# EAGLE design bldc_driver (EAGLE 6.6.0)
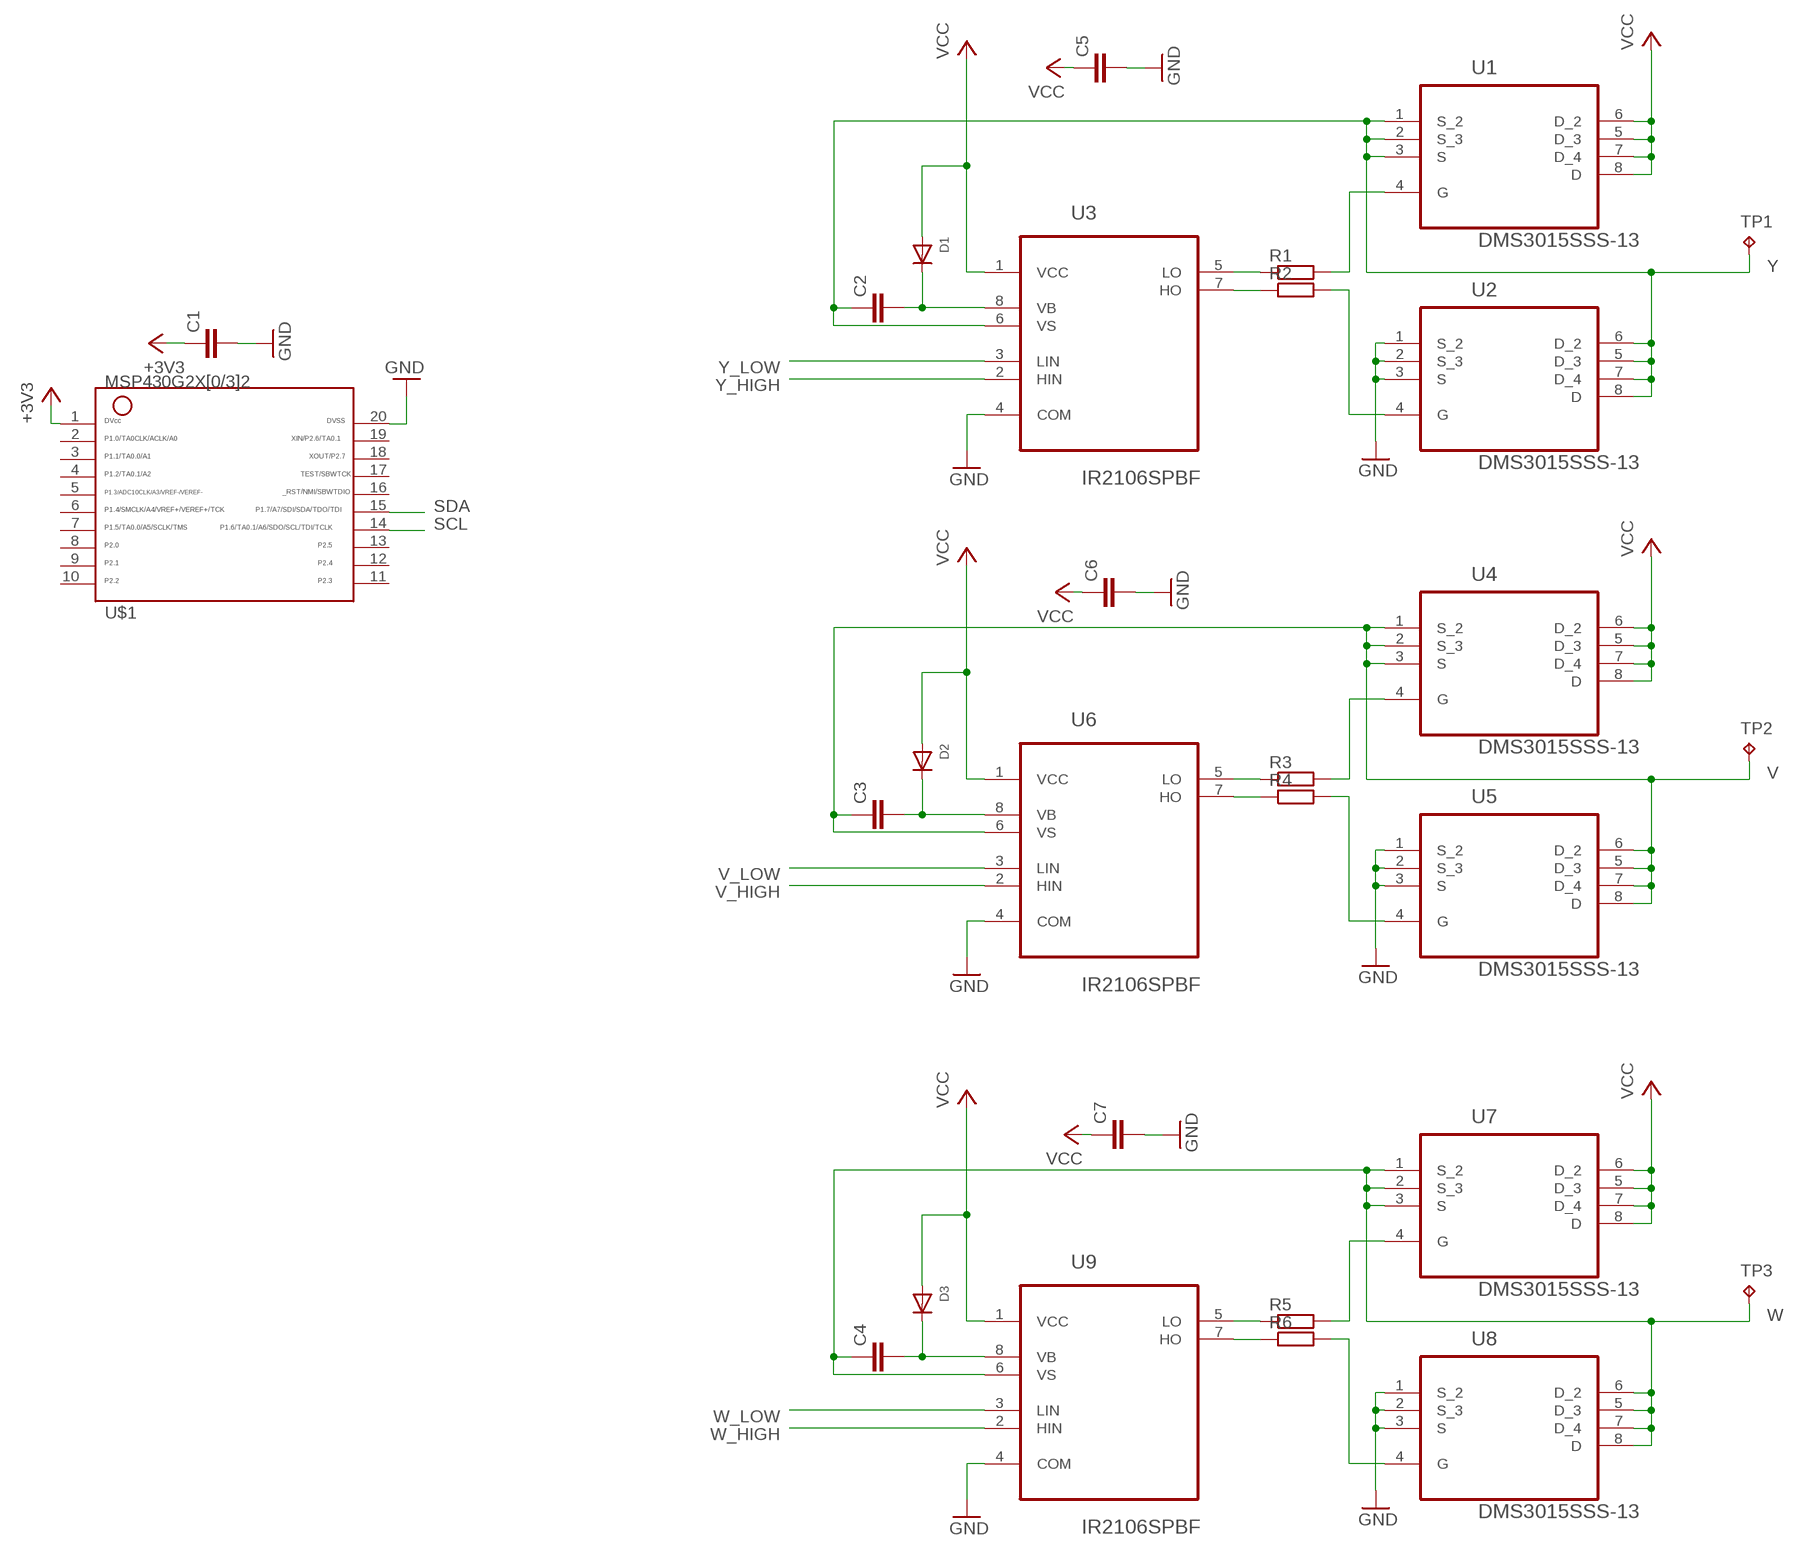
[diagram p0: schematic, sheet 1]

## Parts
C1  C-EUC0805  [C0805]
C2  C-EUC0805  [C0805]
C3  C-EUC0805  [C0805]
C4  C-EUC0805  [C0805]
C5  C-EUC0805  [C0805]
C6  C-EUC0805  [C0805]
C7  C-EUC0805  [C0805]
D1  DIODE_SOD-123FL  [SOD-123FL]
D2  DIODE_SOD-123FL  [SOD-123FL]
D3  DIODE_SOD-123FL  [SOD-123FL]
R1  R-EU_M0805  [M0805]
R2  R-EU_M0805  [M0805]
R3  R-EU_M0805  [M0805]
R4  R-EU_M0805  [M0805]
R5  R-EU_M0805  [M0805]
R6  R-EU_M0805  [M0805]
TP1  TPTP18R  [TP18R]
TP2  TPTP18R  [TP18R]
TP3  TPTP18R  [TP18R]
U1  DMS3015SSS-13  [SOIC127P600X175-8N]
U2  DMS3015SSS-13  [SOIC127P600X175-8N]
U3  IR2106SPBF  [SOIC127P600X175-8N]
U4  DMS3015SSS-13  [SOIC127P600X175-8N]
U5  DMS3015SSS-13  [SOIC127P600X175-8N]
U6  IR2106SPBF  [SOIC127P600X175-8N]
U7  DMS3015SSS-13  [SOIC127P600X175-8N]
U8  DMS3015SSS-13  [SOIC127P600X175-8N]
U9  IR2106SPBF  [SOIC127P600X175-8N]
U$1  G2X[0/3]2---PW20  [PW20]

## Nets
+3V3: C1.1 U$1.1
GND: C1.2 C5.2 C6.2 C7.2 U2.1(S_2) U2.2(S_3) U2.3(S) U3.4(COM) U5.1(S_2) U5.2(S_3) U5.3(S) U6.4(COM) U8.1(S_2) U8.2(S_3) U8.3(S) U9.4(COM) U$1.20
N$1: R1.2 U1.4(G)
N$2: R1.1 U3.5(LO)
N$3: R2.1 U3.7(HO)
N$4: R2.2 U2.4(G)
N$5: C2.2 D1.C U3.8(VB)
N$6: R3.2 U4.4(G)
N$7: R3.1 U6.5(LO)
N$8: R4.1 U6.7(HO)
N$9: R4.2 U5.4(G)
N$10: C3.2 D2.C U6.8(VB)
N$11: R5.2 U7.4(G)
N$12: R5.1 U9.5(LO)
N$13: R6.1 U9.7(HO)
N$14: R6.2 U8.4(G)
N$15: C4.2 D3.C U9.8(VB)
SCL: U$1.14
SDA: U$1.15
V: C3.1 TP2.TP U4.1(S_2) U4.2(S_3) U4.3(S) U5.5(D_3) U5.6(D_2) U5.7(D_4) U5.8(D) U6.6(VS)
V_HIGH: U6.2(HIN)
V_LOW: U6.3(LIN)
VCC: C5.1 C6.1 C7.1 D1.A D2.A D3.A U1.5(D_3) U1.6(D_2) U1.7(D_4) U1.8(D) U3.1(VCC) U4.5(D_3) U4.6(D_2) U4.7(D_4) U4.8(D) U6.1(VCC) U7.5(D_3) U7.6(D_2) U7.7(D_4) U7.8(D) U9.1(VCC)
W: C4.1 TP3.TP U7.1(S_2) U7.2(S_3) U7.3(S) U8.5(D_3) U8.6(D_2) U8.7(D_4) U8.8(D) U9.6(VS)
W_HIGH: U9.2(HIN)
W_LOW: U9.3(LIN)
Y: C2.1 TP1.TP U1.1(S_2) U1.2(S_3) U1.3(S) U2.5(D_3) U2.6(D_2) U2.7(D_4) U2.8(D) U3.6(VS)
Y_HIGH: U3.2(HIN)
Y_LOW: U3.3(LIN)
Unconnected: U$1.2 U$1.3 U$1.4 U$1.5 U$1.6 U$1.7 U$1.8 U$1.9 U$1.10 U$1.11 U$1.12 U$1.13 U$1.16 U$1.17 U$1.18 U$1.19

## Library data of the parts
C1-C7 = my_parts:C-EU: CAPACITOR, European symbol
D1-D3 = adafruit:DIODE: Diode SMADIODE - SMA Surface Mount Package 20V 1A Schottky Diode Digikey: 641-1014-6-ND DO-1N4148 - Through Hole Small Current Diode SOD-123 20V 1 A (.5mV Vf) Schottky Diode - Digikey: MBRX120TPMSCT-ND SOD-323 10V 570mA (.38mV Vf, 3ns) Schottky Diode - Digikey: ZLLS410CT-ND SOD-523 30V 30mA Schottky Diode (RB751S-40TE61) - Digikey: RB751S-40TE61CT-ND SOT23-R/W - SOT23 Package (R = Solder Paste/Reflow Ovens, W = Hand-Soldering) BAT54Film 40V 300mA - Digikey: 497-7162-1-ND
R1-R6 = my_parts:R-EU_: RESISTOR, European symbol
TP1-TP3 = testpad:TP: Test pad
U1 U2 U4 U5 U7 U8 = my_parts:DMS3015SSS-13: ENHANCEMENT MODE MOSFET; MPN: DMS3015SSS-13; OC_FARNELL: 1863728; OC_NEWARK: 27T2703; PACKAGE: SOIC-8; SUPPLIER: DIODES INC.
U3 U6 U9 = my_parts:IR2106SPBF: HIGH AND LOW SIDE DRIVER; MPN: IR2106SPBF; OC_FARNELL: 8638799; OC_NEWARK: -; PACKAGE: SOIC-8; SUPPLIER: INTERNATIONAL RECTIFIER
U$1 = my_parts:G2X[0/3]2---PW20: MSP430G2X[0/3]2 MSP430G2x32, MSP430G2x02 TSSOP (PW) 20 Pin Package http://focus.ti.com/docs/prod/folders/print/msp430g2432.html

## Board
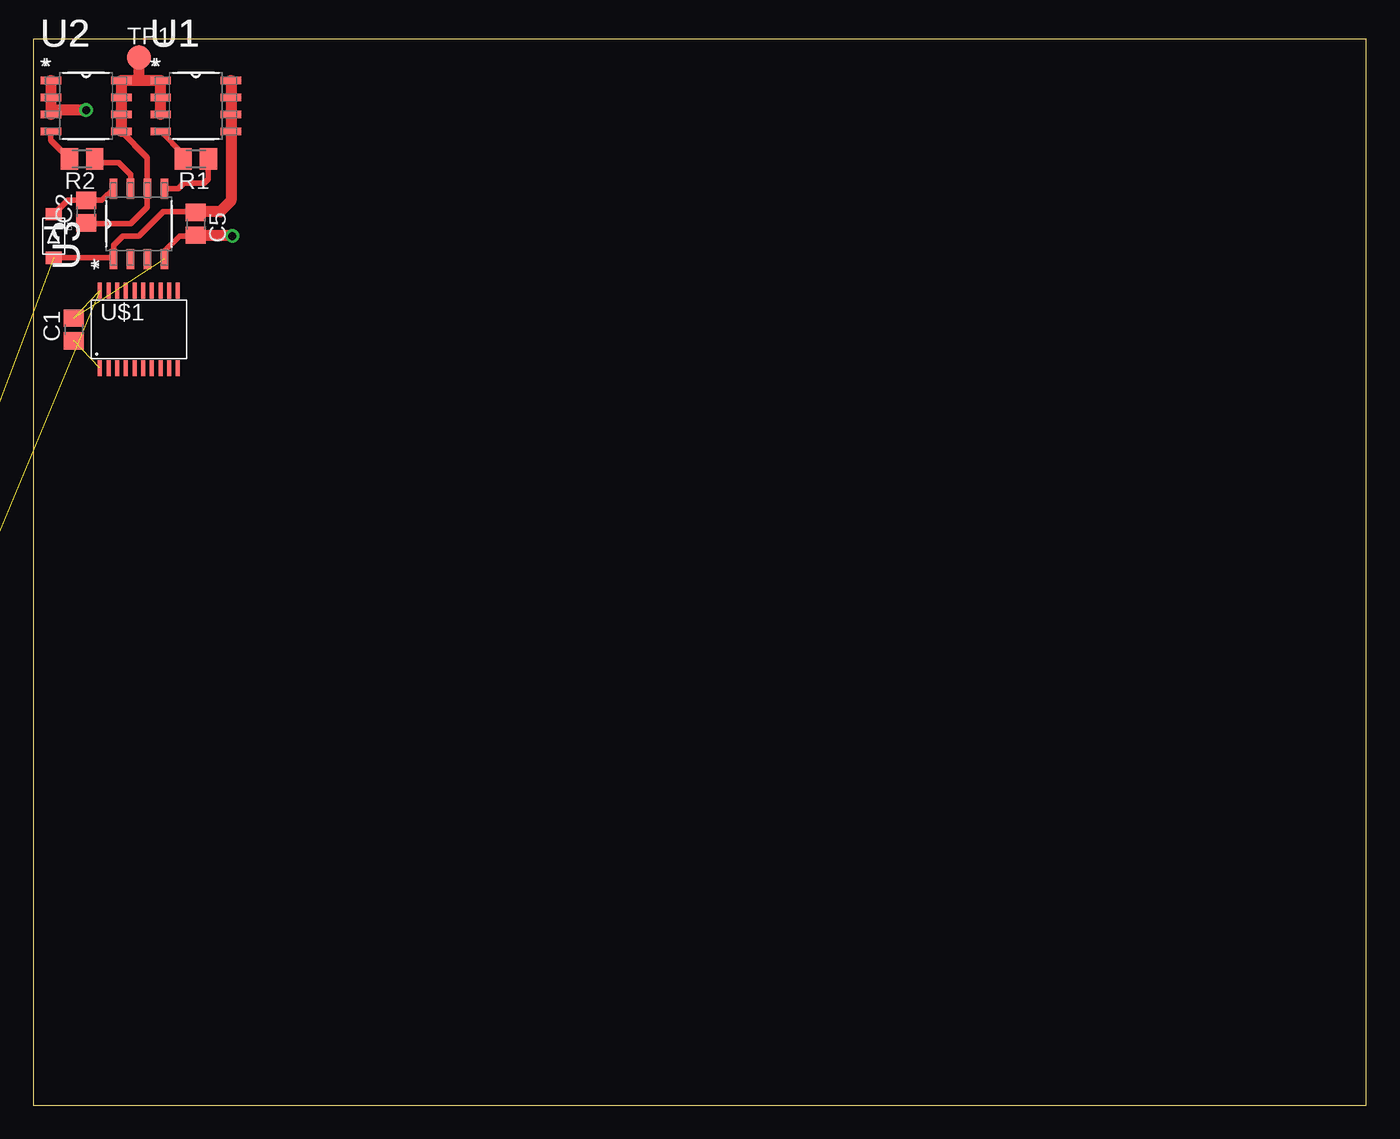
[diagram p1: board, top side]
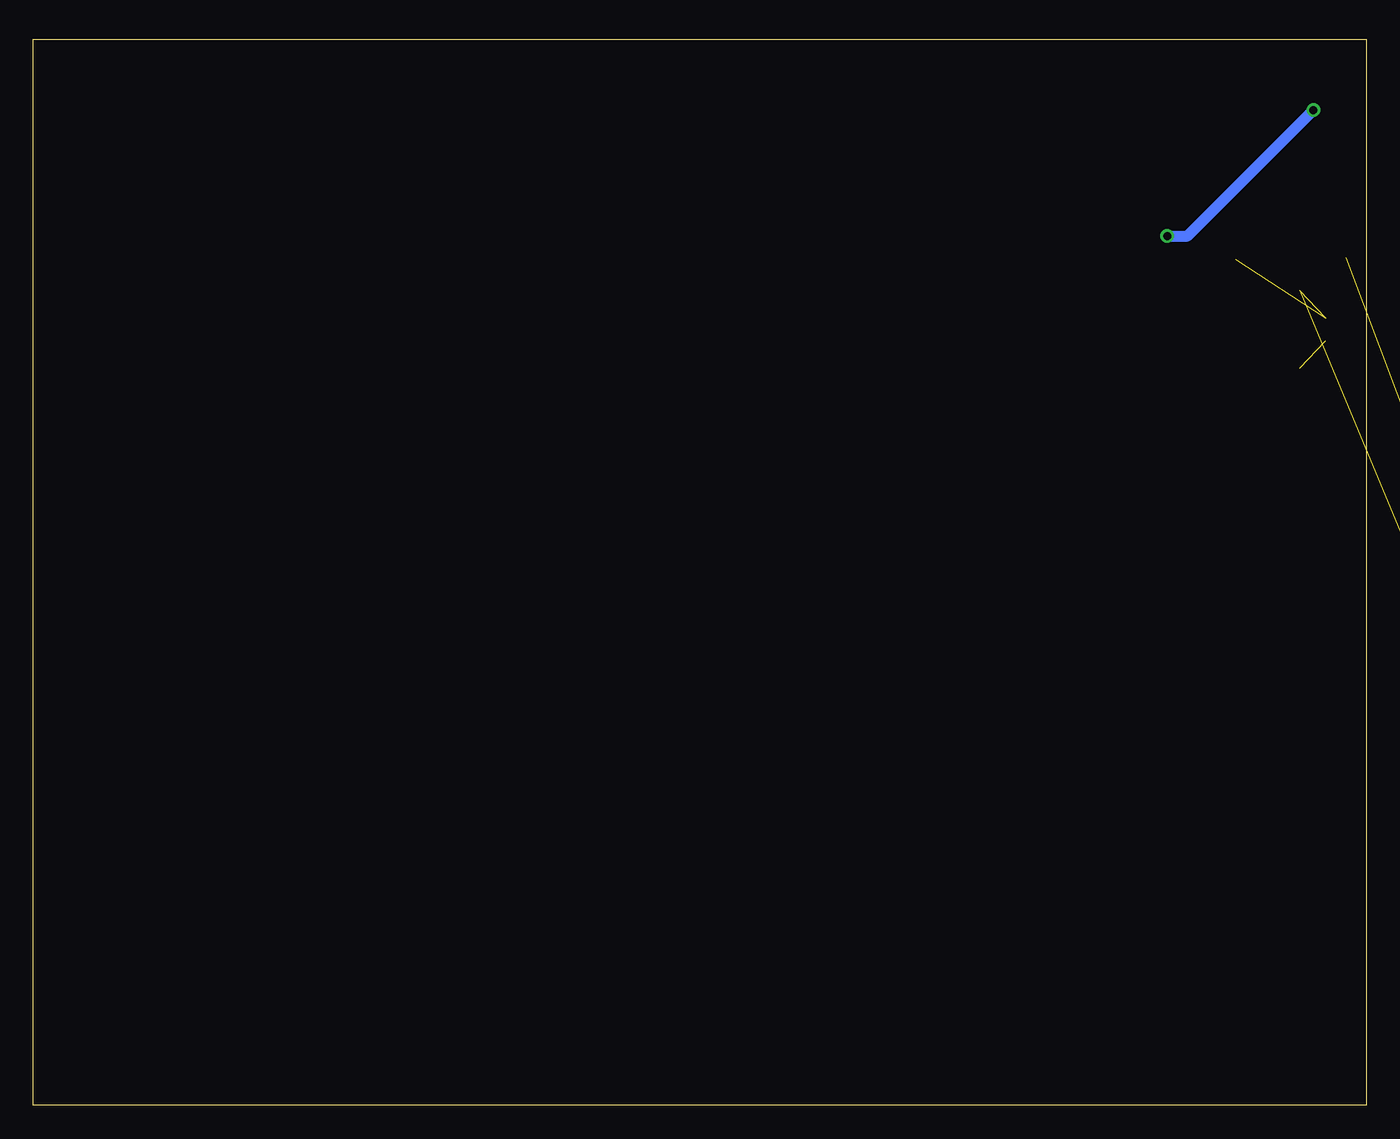
[diagram p2: board, bottom side, seen from below]

Size 100 x 80 mm. Coordinates in mm from the lower left corner, seen from the top.
Outline: 0,0 100,0 100,80 0,80 0,0
Copper layers (1*16): Top 0.035mm / dielectric 1.5mm / Bottom 0.035mm
Design rules "default": minimum track width 10mil, minimum drill 24mil, track to track 8mil, track to pad 8mil, pad to pad 8mil, via to via 8mil, smd to smd 8mil, copper to edge 40mil, drill to drill 8mil, minimum pad ring 10mil, minimum via ring 8mil, stop-mask expansion 4mil, vias tented up to drill 0mil, thermal gap 10mil

### Footprints (pad centres in the part's own frame; a part is rotated, then mirrored left to right if it is on the bottom)
C0805 = smd 1.3 x 1.5: 1 -0.85,0; 2 0.85,0
SOD-123FL = smd 0.91 x 1.22: A 1.637,0; C -1.637,0
M0805 = smd 1.3 x 1.6: 1 -0.95,0; 2 0.95,0
TP18R = smd 1.8 x 1.8: TP 0,0
SOIC127P600X175-8N = smd 1.524 x 0.559: 1 -2.642,1.905; 2 -2.642,0.635; 3 -2.642,-0.635; 4 -2.642,-1.905; 5 2.642,-1.905; 6 2.642,-0.635; 7 2.642,0.635; 8 2.642,1.905
PW20 = smd 0.3 x 1.2: 1 -2.925,-2.9; 2 -2.275,-2.9; 3 -1.625,-2.9; 4 -0.975,-2.9; 5 -0.325,-2.9; 6 0.325,-2.9; 7 0.975,-2.9; 8 1.625,-2.9; 9 2.275,-2.9; 10 2.925,-2.9; 11 2.925,2.9; 12 2.275,2.9; 13 1.625,2.9; 14 0.975,2.9; 15 0.325,2.9; 16 -0.325,2.9; 17 -0.975,2.9; 18 -1.625,2.9; 19 -2.275,2.9; 20 -2.925,2.9

### Placement (x,y rotation side)
C1  3.05,58.22 90 top
C2  3.96,67.06 90 top
C3  -21.95,-61.87 0 top  (outside the outline)
C4  -21.95,-106.98 0 top  (outside the outline)
C5  12.19,66.14 270 top
C6  -41.45,-128.63 0 top  (outside the outline)
C7  -41.45,-132.59 0 top  (outside the outline)
D1  1.52,65.23 270 top
D2  -37.19,-74.68 0 top  (outside the outline)
D3  -37.19,-119.79 0 top  (outside the outline)
R1  12.19,71.02 180 top
R2  3.66,71.02 180 top
R3  -17.68,-61.87 0 top  (outside the outline)
R4  -41.45,-75.59 0 top  (outside the outline)
R5  -17.68,-106.98 0 top  (outside the outline)
R6  -41.45,-120.7 0 top  (outside the outline)
TP1  7.92,78.64 0 top
TP2  -41.76,-140.82 0 top  (outside the outline)
TP3  -41.76,-145.08 0 top  (outside the outline)
U1  12.19,74.98 0 top
U2  3.96,74.98 0 top
U3  7.92,66.14 90 top
U4  -39.01,-39.01 0 top  (outside the outline)
U5  -39.01,-52.73 0 top  (outside the outline)
U6  -39.01,-66.45 0 top  (outside the outline)
U7  -39.01,-84.12 0 top  (outside the outline)
U8  -39.01,-97.84 0 top  (outside the outline)
U9  -39.01,-111.56 0 top  (outside the outline)
U$1  7.92,58.22 0 top

### Tracks (layer width: path | path; a pad name or v marks a point on that pad's centre or on a via)
+3V3  (1 unrouted)
GND  (via drill 0.6)  (12 unrouted)
  Top 0.406: U3.4 9.83,64.08 10.97,65.23 12.13,65.23 C5.2
  Top 0.813: U2.1 U2.2 U2.3 1.65,74.68 v3.96,74.68 | C5.2 14.87,65.29 v14.94,65.23
  Bottom 0.813: v14.94,65.23 13.41,65.23 v3.96,74.68
N$1
  Top 0.406: R1.2 11.24,71.38 U1.4
N$2
  Top 0.406: U3.5 10.87,68.78 11.28,69.19 12.8,69.19 13.11,69.49 13.11,70.98 R1.1
N$3
  Top 0.406: U3.7 7.29,69.83 6.4,70.71 4.91,70.71 R2.1
N$4
  Top 0.406: U2.4 1.32,72.41 R2.2
N$5
  Top 0.406: U3.8 5.14,67.91 C2.2 2.56,67.91 D1.C
N$6  (1 unrouted)
N$7  (1 unrouted)
N$8  (1 unrouted)
N$9  (1 unrouted)
N$10  (2 unrouted)
N$11  (1 unrouted)
N$12  (1 unrouted)
N$13  (1 unrouted)
N$14  (1 unrouted)
N$15  (2 unrouted)
V  (9 unrouted)
VCC  (14 unrouted)
  Top 0.406: D1.A 5.93,63.59 U3.1 6.02,64.54 6.71,65.23 7.92,65.23 9.75,67.06 12.13,67.06 C5.1
  Top 0.813: U1.8 U1.7 U1.6 U1.5 14.83,67.87 14.02,67.06 12.26,67.06 C5.1
W  (9 unrouted)
Y
  Top 0.406: U2.5 8.56,71.12 U3.6 8.56,67.39 7.32,66.14 4.03,66.14 C2.1
  Top 0.813: U2.5 U2.6 U2.7 U2.8 7.62,76.89 | U1.3 U1.2 U1.1 7.62,76.89 | TP1.TP 7.92,77.19 7.62,76.89